# Altium schematic sheet analog_tmp.SchDoc
size A2; SheetNumber: 3; SheetTotal: 3
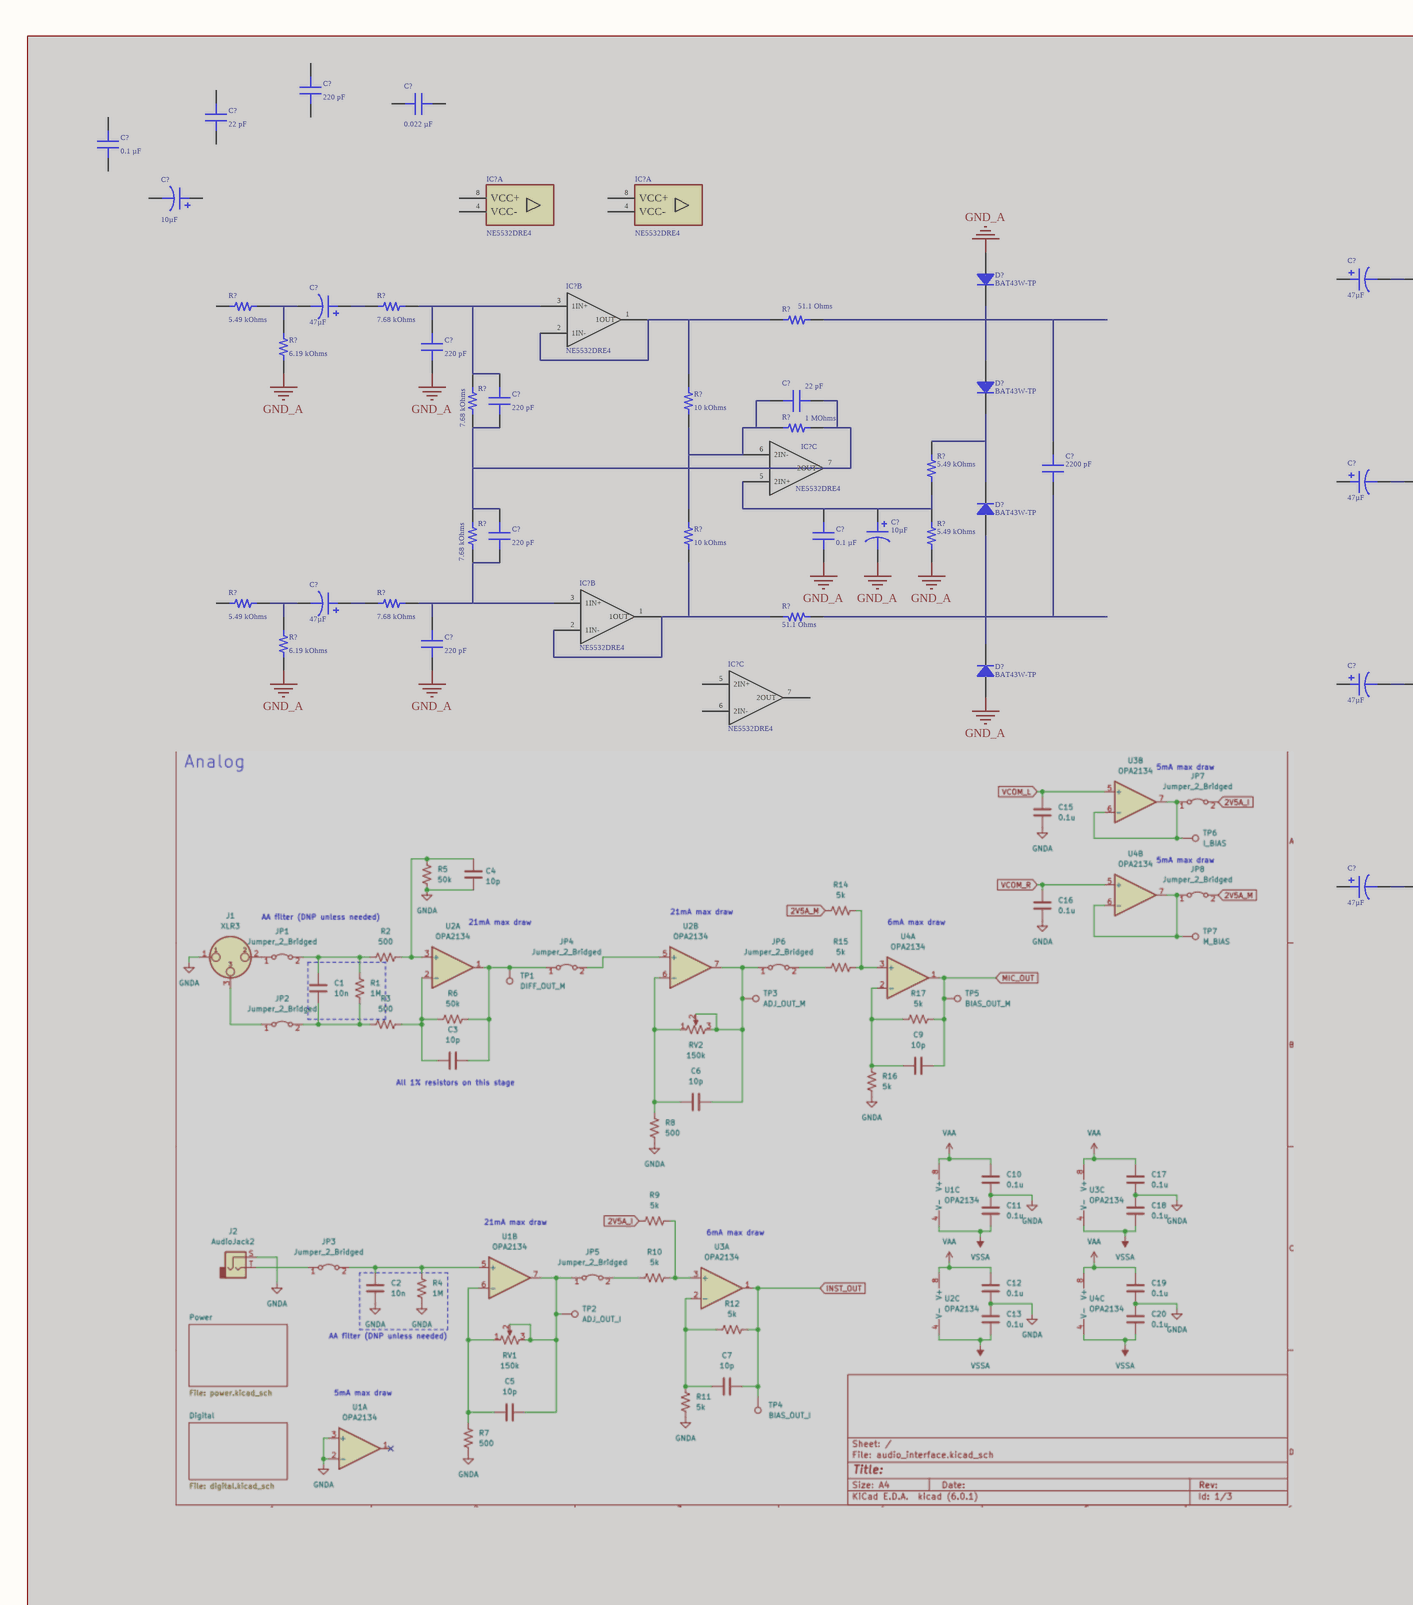
[diagram p0: analog_tmp.SchDoc, left]
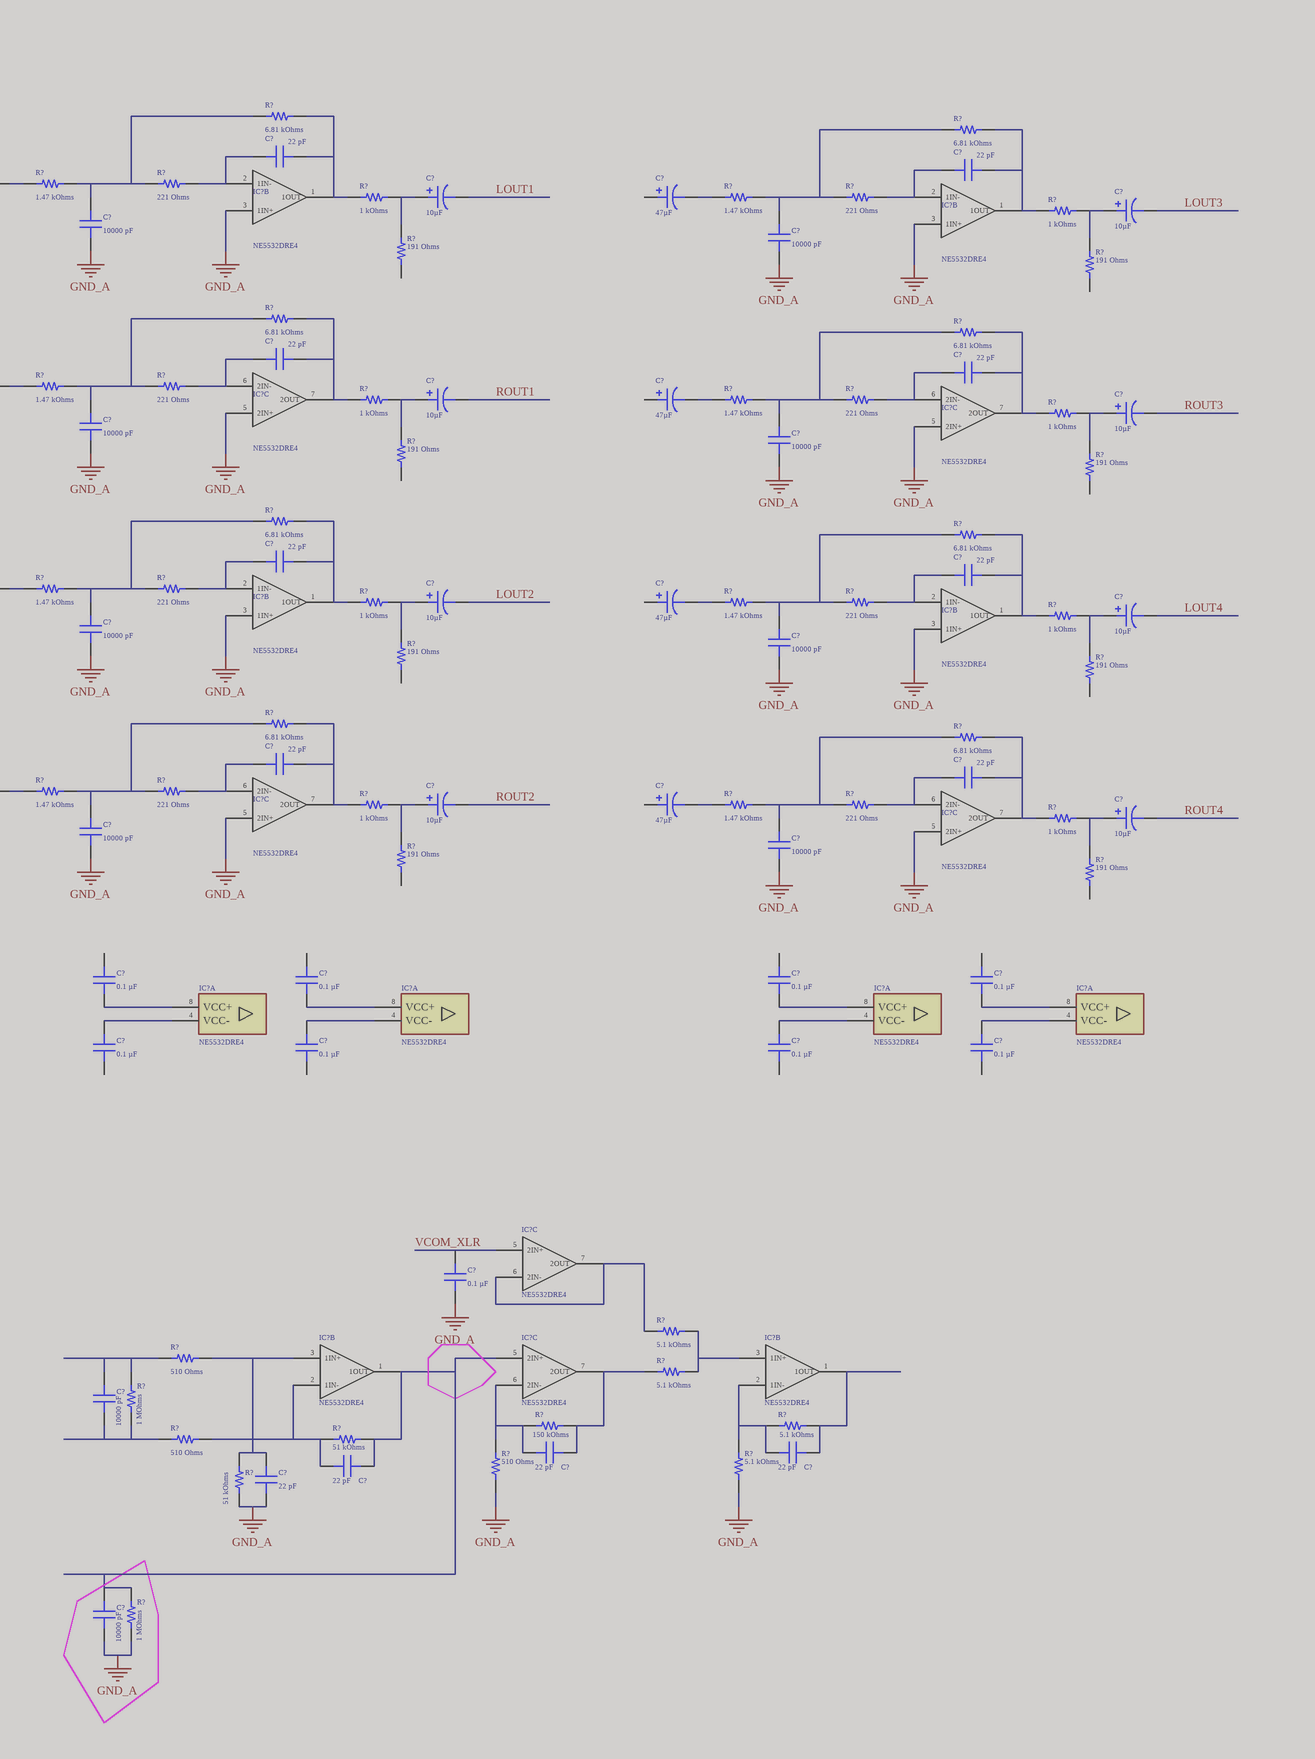
[diagram p1: analog_tmp.SchDoc, right]

## Parts
(Parts that share a designator on the sheet are numbered #1, #2 ... from top to bottom, then left to right.)
C?#1  220 pF  [CAP 0603_1608]  (masked out: inside a compile mask, not in the netlist)
C?#2  0.022 µF  [CAP 0603_1608]  (masked out: inside a compile mask, not in the netlist)
C?#3  22 pF  [CAP 0603_1608]  (masked out: inside a compile mask, not in the netlist)
C?#4  0.1 µF  [CAP 0603_1608]  (masked out: inside a compile mask, not in the netlist)
C?#5  10µF  [CAP POL 1206_3216]  (masked out: inside a compile mask, not in the netlist)
C?#6  22 pF  [CAP 0603_1608]  (masked out: inside a compile mask, not in the netlist)
C?#7  22 pF  [CAP 0603_1608]  (masked out: inside a compile mask, not in the netlist)
C?#8  47µF  [CAP POL 2917_7343]  (masked out: inside a compile mask, not in the netlist)
C?#9  10µF  [CAP POL 1206_3216]  (masked out: inside a compile mask, not in the netlist)
C?#10  47µF  [CAP POL 2917_7343]  (masked out: inside a compile mask, not in the netlist)
C?#11  47µF  [CAP POL 2917_7343]  (masked out: inside a compile mask, not in the netlist)
C?#12  10µF  [CAP POL 1206_3216]  (masked out: inside a compile mask, not in the netlist)
C?#13  10000 pF  [MURATA GRM188 0603_1608]  (masked out: inside a compile mask, not in the netlist)
C?#14  10000 pF  [MURATA GRM188 0603_1608]  (masked out: inside a compile mask, not in the netlist)
C?#15  220 pF  [CAP 0603_1608]  (masked out: inside a compile mask, not in the netlist)
C?#16  220 pF  [CAP 0603_1608]  (masked out: inside a compile mask, not in the netlist)
C?#17  22 pF  [CAP 0603_1608]  (masked out: inside a compile mask, not in the netlist)
C?#18  22 pF  [CAP 0603_1608]  (masked out: inside a compile mask, not in the netlist)
C?#19  2200 pF  [CAP 0603_1608]  (masked out: inside a compile mask, not in the netlist)
C?#20  22 pF  [CAP 0603_1608]  (masked out: inside a compile mask, not in the netlist)
C?#21  47µF  [CAP POL 2917_7343]  (masked out: inside a compile mask, not in the netlist)
C?#22  10µF  [CAP POL 1206_3216]  (masked out: inside a compile mask, not in the netlist)
C?#23  47µF  [CAP POL 2917_7343]  (masked out: inside a compile mask, not in the netlist)
C?#24  10µF  [CAP POL 1206_3216]  (masked out: inside a compile mask, not in the netlist)
C?#25  10000 pF  [MURATA GRM188 0603_1608]  (masked out: inside a compile mask, not in the netlist)
C?#26  220 pF  [CAP 0603_1608]  (masked out: inside a compile mask, not in the netlist)
C?#27  0.1 µF  [CAP 0603_1608]  (masked out: inside a compile mask, not in the netlist)
C?#28  10µF  [CAP POL 1206_3216]  (masked out: inside a compile mask, not in the netlist)
C?#29  10000 pF  [MURATA GRM188 0603_1608]  (masked out: inside a compile mask, not in the netlist)
C?#30  47µF  [CAP POL 2917_7343]  (masked out: inside a compile mask, not in the netlist)
C?#31  220 pF  [CAP 0603_1608]  (masked out: inside a compile mask, not in the netlist)
C?#32  22 pF  [CAP 0603_1608]  (masked out: inside a compile mask, not in the netlist)
C?#33  22 pF  [CAP 0603_1608]  (masked out: inside a compile mask, not in the netlist)
C?#34  47µF  [CAP POL 2917_7343]  (masked out: inside a compile mask, not in the netlist)
C?#35  10µF  [CAP POL 1206_3216]  (masked out: inside a compile mask, not in the netlist)
C?#36  47µF  [CAP POL 2917_7343]  (masked out: inside a compile mask, not in the netlist)
C?#37  10µF  [CAP POL 1206_3216]  (masked out: inside a compile mask, not in the netlist)
C?#38  10000 pF  [MURATA GRM188 0603_1608]  (masked out: inside a compile mask, not in the netlist)
C?#39  10000 pF  [MURATA GRM188 0603_1608]  (masked out: inside a compile mask, not in the netlist)
C?#40  22 pF  [CAP 0603_1608]  (masked out: inside a compile mask, not in the netlist)
C?#41  22 pF  [CAP 0603_1608]  (masked out: inside a compile mask, not in the netlist)
C?#42  47µF  [CAP POL 2917_7343]  (masked out: inside a compile mask, not in the netlist)
C?#43  10µF  [CAP POL 1206_3216]  (masked out: inside a compile mask, not in the netlist)
C?#44  47µF  [CAP POL 2917_7343]  (masked out: inside a compile mask, not in the netlist)
C?#45  10µF  [CAP POL 1206_3216]  (masked out: inside a compile mask, not in the netlist)
C?#46  10000 pF  [MURATA GRM188 0603_1608]  (masked out: inside a compile mask, not in the netlist)
C?#47  10000 pF  [MURATA GRM188 0603_1608]  (masked out: inside a compile mask, not in the netlist)
C?#48  0.1 µF  [CAP 0603_1608]  (masked out: inside a compile mask, not in the netlist)
C?#49  0.1 µF  [CAP 0603_1608]  (masked out: inside a compile mask, not in the netlist)
C?#50  0.1 µF  [CAP 0603_1608]  (masked out: inside a compile mask, not in the netlist)
C?#51  0.1 µF  [CAP 0603_1608]  (masked out: inside a compile mask, not in the netlist)
C?#52  0.1 µF  [CAP 0603_1608]  (masked out: inside a compile mask, not in the netlist)
C?#53  0.1 µF  [CAP 0603_1608]  (masked out: inside a compile mask, not in the netlist)
C?#54  0.1 µF  [CAP 0603_1608]  (masked out: inside a compile mask, not in the netlist)
C?#55  0.1 µF  [CAP 0603_1608]  (masked out: inside a compile mask, not in the netlist)
C?#56  0.1 µF  [CAP 0603_1608]  (masked out: inside a compile mask, not in the netlist)
C?#57  10000 pF  [MURATA GRM188 0603_1608]  (masked out: inside a compile mask, not in the netlist)
C?#58  22 pF  [CAP 0603_1608]  (masked out: inside a compile mask, not in the netlist)
C?#59  22 pF  [CAP 0603_1608]  (masked out: inside a compile mask, not in the netlist)
C?#60  22 pF  [CAP 0603_1608]  (masked out: inside a compile mask, not in the netlist)
C?#61  22 pF  [CAP 0603_1608]  (masked out: inside a compile mask, not in the netlist)
C?#62  10000 pF  [MURATA GRM188 0603_1608]  (masked out: inside a compile mask, not in the netlist)
D?#1  BAT43W-TP  [SOD-123]  (masked out: inside a compile mask, not in the netlist)
D?#2  BAT43W-TP  [SOD-123]  (masked out: inside a compile mask, not in the netlist)
D?#3  BAT43W-TP  [SOD-123]  (masked out: inside a compile mask, not in the netlist)
D?#4  BAT43W-TP  [SOD-123]  (masked out: inside a compile mask, not in the netlist)
IC?#1  NE5532DRE4  [SOIC127P600X175-8N]  (part A of 3)  (masked out: inside a compile mask, not in the netlist)
IC?#2  NE5532DRE4  [SOIC127P600X175-8N]  (part A of 3)  (masked out: inside a compile mask, not in the netlist)
IC?#3  NE5532DRE4  [SOIC127P600X175-8N]  (part B of 3)  (masked out: inside a compile mask, not in the netlist)
IC?#4  NE5532DRE4  [SOIC127P600X175-8N]  (part B of 3)  (masked out: inside a compile mask, not in the netlist)
IC?#5  NE5532DRE4  [SOIC127P600X175-8N]  (part B of 3)  (masked out: inside a compile mask, not in the netlist)
IC?#6  NE5532DRE4  [SOIC127P600X175-8N]  (part C of 3)  (masked out: inside a compile mask, not in the netlist)
IC?#7  NE5532DRE4  [SOIC127P600X175-8N]  (part C of 3)  (masked out: inside a compile mask, not in the netlist)
IC?#8  NE5532DRE4  [SOIC127P600X175-8N]  (part C of 3)  (masked out: inside a compile mask, not in the netlist)
IC?#9  NE5532DRE4  [SOIC127P600X175-8N]  (part B of 3)  (masked out: inside a compile mask, not in the netlist)
IC?#10  NE5532DRE4  [SOIC127P600X175-8N]  (part C of 3)  (masked out: inside a compile mask, not in the netlist)
IC?#11  NE5532DRE4  [SOIC127P600X175-8N]  (part B of 3)  (masked out: inside a compile mask, not in the netlist)
IC?#12  NE5532DRE4  [SOIC127P600X175-8N]  (part B of 3)  (masked out: inside a compile mask, not in the netlist)
IC?#13  NE5532DRE4  [SOIC127P600X175-8N]  (part C of 3)  (masked out: inside a compile mask, not in the netlist)
IC?#14  NE5532DRE4  [SOIC127P600X175-8N]  (part C of 3)  (masked out: inside a compile mask, not in the netlist)
IC?#15  NE5532DRE4  [SOIC127P600X175-8N]  (part A of 3)  (masked out: inside a compile mask, not in the netlist)
IC?#16  NE5532DRE4  [SOIC127P600X175-8N]  (part A of 3)  (masked out: inside a compile mask, not in the netlist)
IC?#17  NE5532DRE4  [SOIC127P600X175-8N]  (part A of 3)  (masked out: inside a compile mask, not in the netlist)
IC?#18  NE5532DRE4  [SOIC127P600X175-8N]  (part A of 3)  (masked out: inside a compile mask, not in the netlist)
IC?#19  NE5532DRE4  [SOIC127P600X175-8N]  (part C of 3)  (masked out: inside a compile mask, not in the netlist)
IC?#20  NE5532DRE4  [SOIC127P600X175-8N]  (part B of 3)  (masked out: inside a compile mask, not in the netlist)
IC?#21  NE5532DRE4  [SOIC127P600X175-8N]  (part C of 3)  (masked out: inside a compile mask, not in the netlist)
IC?#22  NE5532DRE4  [SOIC127P600X175-8N]  (part B of 3)  (masked out: inside a compile mask, not in the netlist)
R?#1  6.81 kOhms  [YAGEO RES 0603_1608]  (masked out: inside a compile mask, not in the netlist)
R?#2  6.81 kOhms  [YAGEO RES 0603_1608]  (masked out: inside a compile mask, not in the netlist)
R?#3  1.47 kOhms  [YAGEO RES 0603_1608]  (masked out: inside a compile mask, not in the netlist)
R?#4  221 Ohms  [YAGEO RES 0603_1608]  (masked out: inside a compile mask, not in the netlist)
R?#5  1 kOhms  [YAGEO RES 0603_1608]  (masked out: inside a compile mask, not in the netlist)
R?#6  1.47 kOhms  [YAGEO RES 0603_1608]  (masked out: inside a compile mask, not in the netlist)
R?#7  221 Ohms  [YAGEO RES 0603_1608]  (masked out: inside a compile mask, not in the netlist)
R?#8  5.49 kOhms  [YAGEO RES 0603_1608]  (masked out: inside a compile mask, not in the netlist)
R?#9  7.68 kOhms  [YAGEO RES 0603_1608]  (masked out: inside a compile mask, not in the netlist)
R?#10  1 kOhms  [YAGEO RES 0603_1608]  (masked out: inside a compile mask, not in the netlist)
R?#11  51.1 Ohms  [YAGEO RES 0603_1608]  (masked out: inside a compile mask, not in the netlist)
R?#12  6.19 kOhms  [YAGEO RES 0603_1608]  (masked out: inside a compile mask, not in the netlist)
R?#13  191 Ohms  [YAGEO RES 0603_1608]  (masked out: inside a compile mask, not in the netlist)
R?#14  191 Ohms  [YAGEO RES 0603_1608]  (masked out: inside a compile mask, not in the netlist)
R?#15  7.68 kOhms  [YAGEO RES 0603_1608]  (masked out: inside a compile mask, not in the netlist)
R?#16  10 kOhms  [RES 0603_1608]  (masked out: inside a compile mask, not in the netlist)
R?#17  6.81 kOhms  [YAGEO RES 0603_1608]  (masked out: inside a compile mask, not in the netlist)
R?#18  value 1 MOhms  [RES 0603_1608]  (masked out: inside a compile mask, not in the netlist)
R?#19  6.81 kOhms  [YAGEO RES 0603_1608]  (masked out: inside a compile mask, not in the netlist)
R?#20  5.49 kOhms  [YAGEO RES 0603_1608]  (masked out: inside a compile mask, not in the netlist)
R?#21  1.47 kOhms  [YAGEO RES 0603_1608]  (masked out: inside a compile mask, not in the netlist)
R?#22  221 Ohms  [YAGEO RES 0603_1608]  (masked out: inside a compile mask, not in the netlist)
R?#23  1 kOhms  [YAGEO RES 0603_1608]  (masked out: inside a compile mask, not in the netlist)
R?#24  1.47 kOhms  [YAGEO RES 0603_1608]  (masked out: inside a compile mask, not in the netlist)
R?#25  221 Ohms  [YAGEO RES 0603_1608]  (masked out: inside a compile mask, not in the netlist)
R?#26  1 kOhms  [YAGEO RES 0603_1608]  (masked out: inside a compile mask, not in the netlist)
R?#27  7.68 kOhms  [YAGEO RES 0603_1608]  (masked out: inside a compile mask, not in the netlist)
R?#28  10 kOhms  [RES 0603_1608]  (masked out: inside a compile mask, not in the netlist)
R?#29  5.49 kOhms  [YAGEO RES 0603_1608]  (masked out: inside a compile mask, not in the netlist)
R?#30  191 Ohms  [YAGEO RES 0603_1608]  (masked out: inside a compile mask, not in the netlist)
R?#31  191 Ohms  [YAGEO RES 0603_1608]  (masked out: inside a compile mask, not in the netlist)
R?#32  5.49 kOhms  [YAGEO RES 0603_1608]  (masked out: inside a compile mask, not in the netlist)
R?#33  7.68 kOhms  [YAGEO RES 0603_1608]  (masked out: inside a compile mask, not in the netlist)
R?#34  51.1 Ohms  [YAGEO RES 0603_1608]  (masked out: inside a compile mask, not in the netlist)
R?#35  6.81 kOhms  [YAGEO RES 0603_1608]  (masked out: inside a compile mask, not in the netlist)
R?#36  6.81 kOhms  [YAGEO RES 0603_1608]  (masked out: inside a compile mask, not in the netlist)
R?#37  6.19 kOhms  [YAGEO RES 0603_1608]  (masked out: inside a compile mask, not in the netlist)
R?#38  1.47 kOhms  [YAGEO RES 0603_1608]  (masked out: inside a compile mask, not in the netlist)
R?#39  221 Ohms  [YAGEO RES 0603_1608]  (masked out: inside a compile mask, not in the netlist)
R?#40  1 kOhms  [YAGEO RES 0603_1608]  (masked out: inside a compile mask, not in the netlist)
R?#41  1.47 kOhms  [YAGEO RES 0603_1608]  (masked out: inside a compile mask, not in the netlist)
R?#42  221 Ohms  [YAGEO RES 0603_1608]  (masked out: inside a compile mask, not in the netlist)
R?#43  1 kOhms  [YAGEO RES 0603_1608]  (masked out: inside a compile mask, not in the netlist)
R?#44  191 Ohms  [YAGEO RES 0603_1608]  (masked out: inside a compile mask, not in the netlist)
R?#45  191 Ohms  [YAGEO RES 0603_1608]  (masked out: inside a compile mask, not in the netlist)
R?#46  6.81 kOhms  [YAGEO RES 0603_1608]  (masked out: inside a compile mask, not in the netlist)
R?#47  6.81 kOhms  [YAGEO RES 0603_1608]  (masked out: inside a compile mask, not in the netlist)
R?#48  1.47 kOhms  [YAGEO RES 0603_1608]  (masked out: inside a compile mask, not in the netlist)
R?#49  221 Ohms  [YAGEO RES 0603_1608]  (masked out: inside a compile mask, not in the netlist)
R?#50  1 kOhms  [YAGEO RES 0603_1608]  (masked out: inside a compile mask, not in the netlist)
R?#51  1.47 kOhms  [YAGEO RES 0603_1608]  (masked out: inside a compile mask, not in the netlist)
R?#52  221 Ohms  [YAGEO RES 0603_1608]  (masked out: inside a compile mask, not in the netlist)
R?#53  1 kOhms  [YAGEO RES 0603_1608]  (masked out: inside a compile mask, not in the netlist)
R?#54  191 Ohms  [YAGEO RES 0603_1608]  (masked out: inside a compile mask, not in the netlist)
R?#55  191 Ohms  [YAGEO RES 0603_1608]  (masked out: inside a compile mask, not in the netlist)
R?#56  5.1 kOhms  [YAGEO RES 0603_1608]  (masked out: inside a compile mask, not in the netlist)
R?#57  510 Ohms  [YAGEO RES 0603_1608]  (masked out: inside a compile mask, not in the netlist)
R?#58  5.1 kOhms  [YAGEO RES 0603_1608]  (masked out: inside a compile mask, not in the netlist)
R?#59  value 1 MOhms  [RES 0603_1608]  (masked out: inside a compile mask, not in the netlist)
R?#60  150 kOhms  [YAGEO RES 0603_1608]  (masked out: inside a compile mask, not in the netlist)
R?#61  5.1 kOhms  [YAGEO RES 0603_1608]  (masked out: inside a compile mask, not in the netlist)
R?#62  510 Ohms  [YAGEO RES 0603_1608]  (masked out: inside a compile mask, not in the netlist)
R?#63  51 kOhms  [YAGEO RES 0603_1608]  (masked out: inside a compile mask, not in the netlist)
R?#64  510 Ohms  [YAGEO RES 0603_1608]  (masked out: inside a compile mask, not in the netlist)
R?#65  5.1 kOhms  [YAGEO RES 0603_1608]  (masked out: inside a compile mask, not in the netlist)
R?#66  51 kOhms  [YAGEO RES 0603_1608]  (masked out: inside a compile mask, not in the netlist)
R?#67  value 1 MOhms  [RES 0603_1608]  (masked out: inside a compile mask, not in the netlist)

## Library data of the parts
C?#1 C?#15 C?#16 C?#26 C?#31 = C0603C221K5RAC7867: CAP CER 220PF 50V X7R 0603; manufacturer: KEMET; Tolerance: ±10%; Part Number: C0603C221K5RAC7867; Value: 220 pF; Applications: Bypass, Decoupling; Capacitance: 220 pF; componentlink1description: Datasheet; componentlink1url: https://api.kemet.com/component-edge/download/datasheet/C0603C221K5RACTU.pdf; componentlink2description: DigiKey Link; componentlink2url: https://www.digikey.com/en/products/detail/kemet/C0603C221K5RAC7867/411073; Device Package: 0603 (1608 Metric); lastupdated: 9/22/2023 7:08:22 PM; Lifecycle Status: Active; Minimum Order: 1; Mounting Type: Surface Mount, MLCC; Operating Temperature: -55°C ~ 125°C; Package / Case: 0603 (1608 Metric); packaging: TapeAndReel; partid: 35307; Part Status: Active; price: 0.01; series: SMD Comm X7R; Size / Dimension: 0.063" L x 0.031" W (1.60mm x 0.80mm); Supplier 1: DigiKey; Supplier Part Number 1: 399-C0603C221K5RAC7867CT-ND; Temperature Coefficient: X7R; Thickness (Max): 0.034" (0.87mm); Voltage - Rated: 50V
C?#2 = C1608X8R1H223K080AA: CAP CER 0.022UF 50V X8R 0603; manufacturer: TDK Corporation; Tolerance: ±10%; Part Number: C1608X8R1H223K080AA; Capacitance: 0.022 µF; Applications: General Purpose; componentlink1description: Datasheet; componentlink1url: https://product.tdk.com/info/en/catalog/datasheets/mlcc_commercial_hightemp_en.pdf?ref_disty=digikey; componentlink2description: DigiKey Link; componentlink2url: https://www.digikey.com/en/products/detail/tdk-corporation/C1608X8R1H223K080AA/927131; Device Package: 0603 (1608 Metric); Features: High Temperature; lastupdated: 2/9/2024 8:10:29 PM; Lifecycle Status: Active; Minimum Order: 1; Mounting Type: Surface Mount, MLCC; Operating Temperature: -55°C ~ 150°C; Package / Case: 0603 (1608 Metric); packaging: TapeAndReel; partid: 2882; Part Status: Active; price: 0.01; series: C; Size / Dimension: 0.063" L x 0.031" W (1.60mm x 0.80mm); Supplier 1: DigiKey; Supplier Part Number 1: 445-2505-1-ND; Temperature Coefficient: X8R; Thickness (Max): 0.035" (0.90mm); value: 0.022 µF; Voltage - Rated: 50V
C?#3 C?#6 C?#7 C?#17 C?#18 C?#20 C?#32 C?#33 C?#40 C?#41 C?#58-C?#61 = CC0603GRNPO9BN220: CAP CER 22PF 50V C0G/NPO 0603; manufacturer: Yageo; Temperature Coefficient: C0G, NP0; Tolerance: ±2%; Part Number: CC0603GRNPO9BN220; Capacitance: 22 pF; Applications: General Purpose; componentlink1description: Datasheet; componentlink1url: https://www.yageo.com/upload/media/product/productsearch/datasheet/mlcc/UPY-GP_NP0_16V-to-50V_17.pdf; componentlink2description: DigiKey Link; componentlink2url: https://www.digikey.com/en/products/detail/yageo/CC0603GRNPO9BN220/5883550; Device Package: 0603 (1608 Metric); lastupdated: 2/9/2024 8:10:28 PM; Lifecycle Status: Active; Minimum Order: 1; Mounting Type: Surface Mount, MLCC; Operating Temperature: -55°C ~ 125°C; Package / Case: 0603 (1608 Metric); packaging: TapeAndReel; partid: 3677; Part Status: Active; price: 0.01; series: CC; Size / Dimension: 0.063" L x 0.031" W (1.60mm x 0.80mm); Supplier 1: DigiKey; Supplier Part Number 1: 311-3925-1-ND; Thickness (Max): 0.035" (0.90mm); value: 22 pF; Voltage - Rated: 50V
C?#4 C?#27 C?#48-C?#56 = C0603C104K5RAC7411: CAP CER 0.1UF 50V X7R 0603; manufacturer: KEMET; Tolerance: ±10%; Part Number: C0603C104K5RAC7411; Value: 0.1 µF; Applications: Bypass, Decoupling; Capacitance: 0.1 µF; componentlink1description: Datasheet; componentlink1url: https://api.kemet.com/component-edge/download/datasheet/C0603C104K5RAC7411.pdf; componentlink2description: DigiKey Link; componentlink2url: https://www.digikey.com/en/products/detail/kemet/C0603C104K5RAC7411/3317013; Device Package: 0603 (1608 Metric); lastupdated: 2/9/2024 8:10:30 PM; Lifecycle Status: Active; Minimum Order: 1; Mounting Type: Surface Mount, MLCC; Operating Temperature: -55°C ~ 125°C; Package / Case: 0603 (1608 Metric); packaging: TapeAndReel; partid: 2233; Part Status: Active; price: 0.01; series: SMD Comm X7R; Size / Dimension: 0.063" L x 0.031" W (1.60mm x 0.80mm); Supplier 1: DigiKey; Supplier Part Number 1: 399-C0603C104K5RAC7411CT-ND; Temperature Coefficient: X7R; Thickness (Max): 0.035" (0.90mm); Voltage - Rated: 50V
C?#5 C?#9 C?#12 C?#22 C?#24 C?#28 C?#35 C?#37 C?#43 C?#45 = T491A106K010AT: CAP TANT 10UF 10% 10V 1206; Manufacturer: KEMET; Manufacturer Size Code: A; ESR (Equivalent Series Resistance): 3.8Ohm; Lifetime @ Temp.: 2000 Hrs @ 125°C; Type: Molded; Part Number: T491A106K010AT; Value: 10µF; Capacitance: 10µF; ComponentLink1Description: Datasheet; ComponentLink1URL: https://api.kemet.com/component-edge/download/datasheet/T491A106K010AT.pdf; ComponentLink2Description: DigiKey Link; ComponentLink2URL: http://digikey.com/product-detail/en/kemet/T491A106K010AT/399-3684-1-ND/819009; Device Package: 1206 (3216 Metric); Features: General Purpose; Height - Seated (Max): 0.071" (1.80mm); LastUpdated: 9/2/2020 1:15:58 AM; Lifecycle Status: Active; Minimum Order: 1; Mounting Type: Surface Mount; Operating Temperature: -55°C ~ 125°C; Package / Case: 1206 (3216 Metric); Packaging: TapeAndReel; PartId: 330; Part Status: Active; Price: 0.07; Series: T491; Size / Dimension: 0.126" L x 0.063" W (3.20mm x 1.60mm); Supplier 1: DigiKey; Supplier Part Number 1: 399-3684-1-ND; Tolerance: ±10%; Voltage - Rated: 10V
C?#8 C?#10 C?#11 C?#21 C?#23 C?#30 C?#34 C?#36 C?#42 C?#44 = 293D476X9010D2TE3: CAP TANT 47UF 10% 10V 2917; Manufacturer: Vishay Sprague; Manufacturer Size Code: D; ESR (Equivalent Series Resistance): 700mOhm; Type: Molded; Part Number: 293D476X9010D2TE3; Value: 47µF; Capacitance: 47µF; ComponentLink1Description: Datasheet; ComponentLink1URL: http://www.vishay.com/docs/40002/293d.pdf; ComponentLink2Description: DigiKey Link; ComponentLink2URL: http://digikey.com/product-detail/en/vishay-sprague/293D476X9010D2TE3/718-1088-1-ND/1559582; Device Package: 2917 (7343 Metric); Features: General Purpose; Height - Seated (Max): 0.122" (3.10mm); LastUpdated: 9/2/2020 1:16:14 AM; Lifecycle Status: Active; Minimum Order: 1; Mounting Type: Surface Mount; Operating Temperature: -55°C ~ 125°C; Package / Case: 2917 (7343 Metric); Packaging: TapeAndReel; PartId: 2778; Part Status: Active; Price: 0.22; Series: TANTAMOUNT®, 293D; Size / Dimension: 0.287" L x 0.169" W (7.30mm x 4.30mm); Supplier 1: DigiKey; Supplier Part Number 1: 718-1088-1-ND; Tolerance: ±10%; Voltage - Rated: 10V
C?#13 C?#14 C?#25 C?#29 C?#38 C?#39 C?#46 C?#47 C?#57 C?#62 = GRM1885C1H103JA01D: CAP CER 10000PF 50V C0G/NP0 0603; manufacturer: Murata Electronics; Temperature Coefficient: C0G, NP0; Tolerance: ±5%; Part Number: GRM1885C1H103JA01D; Capacitance: 10000 pF; Applications: General Purpose; componentlink1description: Datasheet; componentlink1url: https://www.murata.com/~/media/webrenewal/support/library/catalog/products/capacitor/mlcc/c02e.ashx?la=en-us; componentlink2description: DigiKey Link; componentlink2url: https://www.digikey.com/en/products/detail/murata-electronics/GRM1885C1H103JA01D/4421555; Device Package: 0603 (1608 Metric); lastupdated: 7/20/2024 12:23:21 AM; Lifecycle Status: Active; Minimum Order: 1; Mounting Type: Surface Mount, MLCC; Operating Temperature: -55°C ~ 125°C; Package / Case: 0603 (1608 Metric); packaging: TapeAndReel; partid: 11077; Part Status: Active; price: 0.02; series: GRM; Size / Dimension: 0.063" L x 0.031" W (1.60mm x 0.80mm); Supplier 1: DigiKey; Supplier Part Number 1: 490-9666-1-ND; Thickness (Max): 0.035" (0.90mm); value: 10000 pF; Voltage - Rated: 50V
C?#19 = CC0603JRNPO9BN222: CAP CER 2200PF 50V C0G/NPO 0603; manufacturer: Yageo; Temperature Coefficient: C0G, NP0; Tolerance: ±5%; Part Number: CC0603JRNPO9BN222; Capacitance: 2200 pF; Applications: General Purpose; componentlink1description: Datasheet; componentlink1url: https://www.yageo.com/upload/media/product/productsearch/datasheet/mlcc/UPY-GP_NP0_16V-to-50V_17.pdf; componentlink2description: DigiKey Link; componentlink2url: https://www.digikey.com/en/products/detail/yageo/CC0603JRNPO9BN222/5195180; Device Package: 0603 (1608 Metric); lastupdated: 2/9/2024 8:10:30 PM; Lifecycle Status: Active; Minimum Order: 1; Mounting Type: Surface Mount, MLCC; Operating Temperature: -55°C ~ 125°C; Package / Case: 0603 (1608 Metric); packaging: TapeAndReel; partid: 2257; Part Status: Active; price: 0.01; series: CC; Size / Dimension: 0.063" L x 0.031" W (1.60mm x 0.80mm); Supplier 1: DigiKey; Supplier Part Number 1: 311-1771-1-ND; Thickness (Max): 0.035" (0.90mm); value: 2200 pF; Voltage - Rated: 50V
D?#1-D?#4 = BAT43W-TP: DIODE SCHOTTKY 30V 200MA SOD123; Manufacturer: Micro Commercial Co; Capacitance @ Vr, F: 7pF @ 1V, 1MHz; Current - Reverse Leakage @ Vr: 500 nA @ 25 V; Reverse Recovery Time (trr): 5 ns; Speed: Small Signal =< 200mA (Io), Any Speed; Voltage - Forward (Vf) (Max) @ If: 260 mV @ 2 mA; Part Number: BAT43W-TP; ComponentLink1Description: Datasheet; ComponentLink1URL: https://www.mccsemi.com/pdf/Products/BAT42W-BAT43W(SOD-123).pdf; ComponentLink2Description: DigiKey Link; ComponentLink2URL: https://www.digikey.com/en/products/detail/micro-commercial-co/BAT43W-TP/717224; Current - Average Rectified (Io): 200mA; Diode Type: Schottky; LastUpdated: 6/3/2024 7:54:44 PM; Lifecycle Status: Active; Minimum Order: 1; Mounting Type: Surface Mount; Operating Temperature - Junction: -55°C ~ 125°C; Package / Case: SOD-123; Packaging: TapeAndReel; PartId: 2321; Part Status: Active; Price: 0.02; Series: -; Supplier 1: DigiKey; Supplier Part Number 1: BAT43WTPMSCT-ND; Supplier Device Package: SOD-123; Voltage - DC Reverse (Vr) (Max): 30 V
IC?#1-IC?#22 = NE5532DRE4: Integrated Circuit; Manufacturer_Name: Texas Instruments; Datasheet Link: https://www.ti.com/lit/ds/symlink/ne5532.pdf?HQS=dis-mous-null-mousermode-dsf-pf-null-wwe&ts=1618482303902&ref_url=https%253A%252F%252Fwww.mouser.com%252F; Height: 1.75mm; Manufacturer_Part_Number: NE5532DRE4; Mouser Part Number: 595-NE5532DRE4; Mouser Price/Stock: https://www.mouser.co.uk/ProductDetail/Texas-Instruments/NE5532DRE4?qs=7nS3%252BbEUL6spPf9Rt7S6cg%3D%3D; Arrow Part Number: NE5532DRE4; Arrow Price/Stock: https://www.arrow.com/en/products/ne5532dre4/texas-instruments
R?#1 R?#2 R?#17 R?#19 R?#35 R?#36 R?#46 R?#47 = AC0603FR-076K81L: RES SMD 6.81K OHM 1% 1/10W 0603; Manufacturer: Yageo; Power (Watts): 0.1W, 1/10W; Temperature Coefficient: ±100ppm/°C; Part Number: AC0603FR-076K81L; Value: 6.81 kOhms; ComponentLink1Description: Datasheet; ComponentLink1URL: https://www.yageo.com/upload/media/product/productsearch/datasheet/rchip/PYu-AC_51_RoHS_L_7.pdf; ComponentLink2Description: DigiKey Link; ComponentLink2URL: https://www.digikey.com/en/products/detail/yageo/AC0603FR-076K81L/5896265; Composition: Thick Film; Device Package: 0603 (1608 Metric); Features: Automotive AEC-Q200, Moisture Resistant; Height - Seated (Max): 0.022" (0.55mm); LastUpdated: 7/25/2024 9:19:28 AM; Lifecycle Status: Active; Minimum Order: 1; Number of Terminations: 2; Operating Temperature: -55°C ~ 155°C; Package / Case: 0603 (1608 Metric); Packaging: CutTape; PartId: 11704; Part Status: Active; Price: 0.01; Ratings: AEC-Q200; Resistance: 6.81 kOhms; Series: AC; Size / Dimension: 0.063" L x 0.031" W (1.60mm x 0.80mm); Supplier 1: DigiKey; Supplier Part Number 1: YAG3626CT-ND; Supplier Device Package: 0603; Tolerance: ±1%
R?#3 R?#6 R?#21 R?#24 R?#38 R?#41 R?#48 R?#51 = AC0603FR-071K47L: RES SMD 1.47K OHM 1% 1/10W 0603; Manufacturer: Yageo; Power (Watts): 0.1W, 1/10W; Temperature Coefficient: ±100ppm/°C; Part Number: AC0603FR-071K47L; Value: 1.47 kOhms; ComponentLink1Description: Datasheet; ComponentLink1URL: https://www.yageo.com/upload/media/product/productsearch/datasheet/rchip/PYu-AC_51_RoHS_L_8.pdf; ComponentLink2Description: DigiKey Link; ComponentLink2URL: https://www.digikey.com/en/products/detail/yageo/AC0603FR-071K47L/5895863; Composition: Thick Film; Device Package: 0603 (1608 Metric); Features: Automotive AEC-Q200, Moisture Resistant; Height - Seated (Max): 0.022" (0.55mm); LastUpdated: 7/25/2024 9:19:11 AM; Lifecycle Status: Active; Minimum Order: 1; Number of Terminations: 2; Operating Temperature: -55°C ~ 155°C; Package / Case: 0603 (1608 Metric); Packaging: CutTape; PartId: 65725; Part Status: Active; Price: 0.01; Ratings: AEC-Q200; Resistance: 1.47 kOhms; Series: AC; Size / Dimension: 0.063" L x 0.031" W (1.60mm x 0.80mm); Supplier 1: DigiKey; Supplier Part Number 1: 13-AC0603FR-071K47LCT-ND; Supplier Device Package: 0603; Tolerance: ±1%
R?#4 R?#7 R?#22 R?#25 R?#39 R?#42 R?#49 R?#52 = AC0603FR-07221RL: RES SMD 221 OHM 1% 1/10W 0603; Manufacturer: Yageo; Power (Watts): 0.1W, 1/10W; Temperature Coefficient: ±100ppm/°C; Part Number: AC0603FR-07221RL; Value: 221 Ohms; ComponentLink1Description: Datasheet; ComponentLink1URL: https://www.yageo.com/upload/media/product/productsearch/datasheet/rchip/PYu-AC_51_RoHS_L_10.pdf; ComponentLink2Description: DigiKey Link; ComponentLink2URL: https://www.digikey.com/en/products/detail/yageo/AC0603FR-07221RL/5895921; Composition: Thick Film; Device Package: 0603 (1608 Metric); Features: Automotive AEC-Q200, Moisture Resistant; Height - Seated (Max): 0.022" (0.55mm); LastUpdated: 7/25/2024 9:18:59 AM; Lifecycle Status: Active; Minimum Order: 1; Number of Terminations: 2; Operating Temperature: -55°C ~ 155°C; Package / Case: 0603 (1608 Metric); Packaging: CutTape; PartId: 87217; Price: 0.01; Ratings: AEC-Q200; Resistance: 221 Ohms; Series: AC; Size / Dimension: 0.063" L x 0.031" W (1.60mm x 0.80mm); Supplier 1: DigiKey; Supplier Part Number 1: 13-AC0603FR-07221RLCT-ND; Supplier Device Package: 0603; Tolerance: ±1%
R?#5 R?#10 R?#23 R?#26 R?#40 R?#43 R?#50 R?#53 = AA0603FR-071KL: RES SMD 1K OHM 1% 1/10W 0603; Manufacturer: Yageo; Power (Watts): 0.1W, 1/10W; Temperature Coefficient: ±150ppm/°C; Part Number: AA0603FR-071KL; Value: 1 kOhms; ComponentLink1Description: Datasheet; ComponentLink1URL: https://www.yageo.com/upload/media/product/productsearch/datasheet/rchip/PYu-AA_51_RoHS_L_3.pdf; ComponentLink2Description: DigiKey Link; ComponentLink2URL: https://www.digikey.com/en/products/detail/yageo/AA0603FR-071KL/5888847; Composition: Thick Film; Device Package: 0603 (1608 Metric); Features: Anti-Sulfur, Automotive AEC-Q200, Moisture Resistant; Height - Seated (Max): 0.022" (0.55mm); LastUpdated: 7/25/2024 9:19:15 AM; Lifecycle Status: Active; Minimum Order: 1; Number of Terminations: 2; Operating Temperature: -55°C ~ 155°C; Package / Case: 0603 (1608 Metric); Packaging: TapeAndReel; PartId: 64335; Part Status: Active; Price: 0.01; Ratings: AEC-Q200; Resistance: 1 kOhms; Series: AA; Size / Dimension: 0.063" L x 0.031" W (1.60mm x 0.80mm); Supplier 1: DigiKey; Supplier Part Number 1: 13-AA0603FR-071KLCT-ND; Supplier Device Package: 0603; Tolerance: ±1%
R?#8 R?#20 R?#29 R?#32 = AC0603FR-075K49L: RES SMD 5.49K OHM 1% 1/10W 0603; Manufacturer: Yageo; Power (Watts): 0.1W, 1/10W; Temperature Coefficient: ±100ppm/°C; Part Number: AC0603FR-075K49L; Value: 5.49 kOhms; ComponentLink1Description: Datasheet; ComponentLink1URL: https://www.yageo.com/upload/media/product/productsearch/datasheet/rchip/PYu-AC_51_RoHS_L_8.pdf; ComponentLink2Description: DigiKey Link; ComponentLink2URL: https://www.digikey.com/en/products/detail/yageo/AC0603FR-075K49L/5896212; Composition: Thick Film; Device Package: 0603 (1608 Metric); Features: Automotive AEC-Q200, Moisture Resistant; Height - Seated (Max): 0.022" (0.55mm); LastUpdated: 7/25/2024 9:19:14 AM; Lifecycle Status: Active; Minimum Order: 1; Number of Terminations: 2; Operating Temperature: -55°C ~ 155°C; Package / Case: 0603 (1608 Metric); Packaging: CutTape; PartId: 64236; Part Status: Active; Price: 0.01; Ratings: AEC-Q200; Resistance: 5.49 kOhms; Series: AC; Size / Dimension: 0.063" L x 0.031" W (1.60mm x 0.80mm); Supplier 1: DigiKey; Supplier Part Number 1: 13-AC0603FR-075K49LCT-ND; Supplier Device Package: 0603; Tolerance: ±1%
R?#9 R?#15 R?#27 R?#33 = AC0603FR-077K68L: RES SMD 7.68K OHM 1% 1/10W 0603; Manufacturer: Yageo; Power (Watts): 0.1W, 1/10W; Temperature Coefficient: ±100ppm/°C; Part Number: AC0603FR-077K68L; Value: 7.68 kOhms; ComponentLink1Description: Datasheet; ComponentLink1URL: https://www.yageo.com/upload/media/product/productsearch/datasheet/rchip/PYu-AC_51_RoHS_L_10.pdf; ComponentLink2Description: DigiKey Link; ComponentLink2URL: https://www.digikey.com/en/products/detail/yageo/AC0603FR-077K68L/5896295; Composition: Thick Film; Device Package: 0603 (1608 Metric); Features: Automotive AEC-Q200, Moisture Resistant; Height - Seated (Max): 0.022" (0.55mm); LastUpdated: 7/25/2024 9:19:03 AM; Lifecycle Status: Active; Minimum Order: 1; Number of Terminations: 2; Operating Temperature: -55°C ~ 155°C; Package / Case: 0603 (1608 Metric); Packaging: CutTape; PartId: 79450; Price: 0.01; Ratings: AEC-Q200; Resistance: 7.68 kOhms; Series: AC; Size / Dimension: 0.063" L x 0.031" W (1.60mm x 0.80mm); Supplier 1: DigiKey; Supplier Part Number 1: 13-AC0603FR-077K68LCT-ND; Supplier Device Package: 0603; Tolerance: ±1%
R?#11 R?#34 = AC0603FR-0751R1L: RES SMD 51.1 OHM 1% 1/10W 0603; Manufacturer: Yageo; Power (Watts): 0.1W, 1/10W; Temperature Coefficient: ±100ppm/°C; Part Number: AC0603FR-0751R1L; Value: 51.1 Ohms; ComponentLink1Description: Datasheet; ComponentLink1URL: https://www.yageo.com/upload/media/product/productsearch/datasheet/rchip/PYu-AC_51_RoHS_L_9.pdf; ComponentLink2Description: DigiKey Link; ComponentLink2URL: https://www.digikey.com/en/products/detail/yageo/AC0603FR-0751R1L/5896180; Composition: Thick Film; Device Package: 0603 (1608 Metric); Features: Automotive AEC-Q200, Moisture Resistant; Height - Seated (Max): 0.022" (0.55mm); LastUpdated: 7/25/2024 9:19:05 AM; Lifecycle Status: Active; Minimum Order: 1; Number of Terminations: 2; Operating Temperature: -55°C ~ 155°C; Package / Case: 0603 (1608 Metric); Packaging: CutTape; PartId: 75740; Part Status: Active; Price: 0.01; Ratings: AEC-Q200; Resistance: 51.1 Ohms; Series: AC; Size / Dimension: 0.063" L x 0.031" W (1.60mm x 0.80mm); Supplier 1: DigiKey; Supplier Part Number 1: 13-AC0603FR-0751R1LCT-ND; Supplier Device Package: 0603; Tolerance: ±1%
R?#12 R?#37 = AC0603FR-076K19L: RES SMD 6.19K OHM 1% 1/10W 0603; Manufacturer: Yageo; Power (Watts): 0.1W, 1/10W; Temperature Coefficient: ±100ppm/°C; Part Number: AC0603FR-076K19L; Value: 6.19 kOhms; ComponentLink1Description: Datasheet; ComponentLink1URL: https://www.yageo.com/upload/media/product/productsearch/datasheet/rchip/PYu-AC_51_RoHS_L_9.pdf; ComponentLink2Description: DigiKey Link; ComponentLink2URL: https://www.digikey.com/en/products/detail/yageo/AC0603FR-076K19L/5896260; Composition: Thick Film; Device Package: 0603 (1608 Metric); Features: Automotive AEC-Q200, Moisture Resistant; Height - Seated (Max): 0.022" (0.55mm); LastUpdated: 7/25/2024 9:19:07 AM; Lifecycle Status: Active; Minimum Order: 1; Number of Terminations: 2; Operating Temperature: -55°C ~ 155°C; Package / Case: 0603 (1608 Metric); Packaging: CutTape; PartId: 72125; Part Status: Active; Price: 0.01; Ratings: AEC-Q200; Resistance: 6.19 kOhms; Series: AC; Size / Dimension: 0.063" L x 0.031" W (1.60mm x 0.80mm); Supplier 1: DigiKey; Supplier Part Number 1: 13-AC0603FR-076K19LCT-ND; Supplier Device Package: 0603; Tolerance: ±1%
R?#13 R?#14 R?#30 R?#31 R?#44 R?#45 R?#54 R?#55 = AC0603FR-07191RL: RES SMD 191 OHM 1% 1/10W 0603; Manufacturer: Yageo; Power (Watts): 0.1W, 1/10W; Temperature Coefficient: ±100ppm/°C; Part Number: AC0603FR-07191RL; Value: 191 Ohms; ComponentLink1Description: Datasheet; ComponentLink1URL: https://www.yageo.com/upload/media/product/productsearch/datasheet/rchip/PYu-AC_51_RoHS_L_9.pdf; ComponentLink2Description: DigiKey Link; ComponentLink2URL: https://www.digikey.com/en/products/detail/yageo/AC0603FR-07191RL/5895841; Composition: Thick Film; Device Package: 0603 (1608 Metric); Features: Automotive AEC-Q200, Moisture Resistant; Height - Seated (Max): 0.022" (0.55mm); LastUpdated: 7/25/2024 9:19:07 AM; Lifecycle Status: Active; Minimum Order: 1; Number of Terminations: 2; Operating Temperature: -55°C ~ 155°C; Package / Case: 0603 (1608 Metric); Packaging: CutTape; PartId: 72108; Part Status: Active; Price: 0.01; Ratings: AEC-Q200; Resistance: 191 Ohms; Series: AC; Size / Dimension: 0.063" L x 0.031" W (1.60mm x 0.80mm); Supplier 1: DigiKey; Supplier Part Number 1: 13-AC0603FR-07191RLCT-ND; Supplier Device Package: 0603; Tolerance: ±1%
R?#16 R?#28 = ERJ-3EKF1002V: RES SMD 10K OHM 1% 1/10W 0603; Manufacturer: Panasonic Electronic Components; Power (Watts): 0.1W, 1/10W; Temperature Coefficient: ±100ppm/°C; Part Number: ERJ-3EKF1002V; Value: 10 kOhms; ComponentLink1Description: Datasheet; ComponentLink1URL: https://industrial.panasonic.com/cdbs/www-data/pdf/RDA0000/AOA0000C304.pdf; ComponentLink2Description: DigiKey Link; ComponentLink2URL: https://www.digikey.com/en/products/detail/panasonic-electronic-components/ERJ-3EKF1002V/196066; Composition: Thick Film; Device Package: 0603 (1608 Metric); Height - Seated (Max): 0.022" (0.55mm); LastUpdated: 2/9/2024 8:41:59 PM; Lifecycle Status: Active; Minimum Order: 1; Number of Terminations: 2; Operating Temperature: -55°C ~ 155°C; Package / Case: 0603 (1608 Metric); Packaging: TapeAndReel; PartId: 25695; Part Status: Active; Price: 0.01; Resistance: 10 kOhms; Series: ERJ-3EK; Size / Dimension: 0.063" L x 0.031" W (1.60mm x 0.80mm); Supplier 1: DigiKey; Supplier Part Number 1: P10.0KHCT-ND; Supplier Device Package: 0603; Tolerance: ±1%; Features: Automotive AEC-Q200; Ratings: AEC-Q200
R?#18 R?#59 R?#67 = ERJ-3EKF1004V: RES SMD 1M OHM 1% 1/10W 0603; Manufacturer: Panasonic Electronic Components; Power (Watts): 0.1W, 1/10W; Temperature Coefficient: ±100ppm/°C; Part Number: ERJ-3EKF1004V; ComponentLink1Description: Datasheet; ComponentLink1URL: https://industrial.panasonic.com/cdbs/www-data/pdf/RDA0000/AOA0000C304.pdf; ComponentLink2Description: DigiKey Link; ComponentLink2URL: https://www.digikey.com/en/products/detail/panasonic-electronic-components/ERJ-3EKF1004V/196033; Composition: Thick Film; Device Package: 0603 (1608 Metric); Height - Seated (Max): 0.022" (0.55mm); LastUpdated: 2/9/2024 8:42:00 PM; Lifecycle Status: Active; Minimum Order: 1; Number of Terminations: 2; Operating Temperature: -55°C ~ 155°C; Package / Case: 0603 (1608 Metric); Packaging: TapeAndReel; PartId: 25691; Part Status: Active; Price: 0.01; Resistance: 1 MOhms; Series: ERJ-3EK; Size / Dimension: 0.063" L x 0.031" W (1.60mm x 0.80mm); Supplier 1: DigiKey; Supplier Part Number 1: P1.00MHCT-ND; Supplier Device Package: 0603; Tolerance: ±1%; Features: Automotive AEC-Q200; Ratings: AEC-Q200
R?#56 R?#58 R?#61 R?#65 = AC0603FR-075K1L: RES SMD 5.1K OHM 1% 1/10W 0603; Manufacturer: Yageo; Power (Watts): 0.1W, 1/10W; Temperature Coefficient: ±100ppm/°C; Part Number: AC0603FR-075K1L; Value: 5.1 kOhms; ComponentLink1Description: Datasheet; ComponentLink1URL: https://www.yageo.com/upload/media/product/productsearch/datasheet/rchip/PYu-AC_51_RoHS_L_7.pdf; ComponentLink2Description: DigiKey Link; ComponentLink2URL: https://www.digikey.com/en/products/detail/yageo/AC0603FR-075K1L/5896209; Composition: Thick Film; Device Package: 0603 (1608 Metric); Features: Automotive AEC-Q200, Moisture Resistant; Height - Seated (Max): 0.022" (0.55mm); LastUpdated: 7/25/2024 9:19:23 AM; Lifecycle Status: Active; Minimum Order: 1; Number of Terminations: 2; Operating Temperature: -55°C ~ 155°C; Package / Case: 0603 (1608 Metric); Packaging: CutTape; PartId: 17442; Part Status: Active; Price: 0.01; Ratings: AEC-Q200; Resistance: 5.1 kOhms; Series: AC; Size / Dimension: 0.063" L x 0.031" W (1.60mm x 0.80mm); Supplier 1: DigiKey; Supplier Part Number 1: YAG3621CT-ND; Supplier Device Package: 0603; Tolerance: ±1%
R?#57 R?#62 R?#64 = AC0603FR-07510RL: RES SMD 510 OHM 1% 1/10W 0603; Manufacturer: Yageo; Power (Watts): 0.1W, 1/10W; Temperature Coefficient: ±100ppm/°C; Part Number: AC0603FR-07510RL; Value: 510 Ohms; ComponentLink1Description: Datasheet; ComponentLink1URL: https://www.yageo.com/upload/media/product/productsearch/datasheet/rchip/PYu-AC_51_RoHS_L_7.pdf; ComponentLink2Description: DigiKey Link; ComponentLink2URL: https://www.digikey.com/en/products/detail/yageo/AC0603FR-07510RL/5896175; Composition: Thick Film; Device Package: 0603 (1608 Metric); Features: Automotive AEC-Q200, Moisture Resistant; Height - Seated (Max): 0.022" (0.55mm); LastUpdated: 7/25/2024 9:19:25 AM; Lifecycle Status: Active; Minimum Order: 1; Number of Terminations: 2; Operating Temperature: -55°C ~ 155°C; Package / Case: 0603 (1608 Metric); Packaging: CutTape; PartId: 15979; Part Status: Active; Price: 0.01; Ratings: AEC-Q200; Resistance: 510 Ohms; Series: AC; Size / Dimension: 0.063" L x 0.031" W (1.60mm x 0.80mm); Supplier 1: DigiKey; Supplier Part Number 1: YAG3615CT-ND; Supplier Device Package: 0603; Tolerance: ±1%
R?#60 = AC0603FR-07150KL: RES SMD 150K OHM 1% 1/10W 0603; Manufacturer: Yageo; Power (Watts): 0.1W, 1/10W; Temperature Coefficient: ±100ppm/°C; Part Number: AC0603FR-07150KL; Value: 150 kOhms; ComponentLink1Description: Datasheet; ComponentLink1URL: https://www.yageo.com/upload/media/product/productsearch/datasheet/rchip/PYu-AC_51_RoHS_L_7.pdf; ComponentLink2Description: DigiKey Link; ComponentLink2URL: https://www.digikey.com/en/products/detail/yageo/AC0603FR-07150KL/5895795; Composition: Thick Film; Device Package: 0603 (1608 Metric); Features: Automotive AEC-Q200, Moisture Resistant; Height - Seated (Max): 0.022" (0.55mm); LastUpdated: 7/25/2024 9:19:23 AM; Lifecycle Status: Active; Minimum Order: 1; Number of Terminations: 2; Operating Temperature: -55°C ~ 155°C; Package / Case: 0603 (1608 Metric); Packaging: CutTape; PartId: 17374; Part Status: Active; Price: 0.01; Ratings: AEC-Q200; Resistance: 150 kOhms; Series: AC; Size / Dimension: 0.063" L x 0.031" W (1.60mm x 0.80mm); Supplier 1: DigiKey; Supplier Part Number 1: YAG3567CT-ND; Supplier Device Package: 0603; Tolerance: ±1%
R?#63 R?#66 = AC0603FR-0751KL: RES SMD 51K OHM 1% 1/10W 0603; Manufacturer: Yageo; Power (Watts): 0.1W, 1/10W; Temperature Coefficient: ±100ppm/°C; Part Number: AC0603FR-0751KL; Value: 51 kOhms; ComponentLink1Description: Datasheet; ComponentLink1URL: https://www.yageo.com/upload/media/product/productsearch/datasheet/rchip/PYu-AC_51_RoHS_L_7.pdf; ComponentLink2Description: DigiKey Link; ComponentLink2URL: https://www.digikey.com/en/products/detail/yageo/AC0603FR-0751KL/5896179; Composition: Thick Film; Device Package: 0603 (1608 Metric); Features: Automotive AEC-Q200, Moisture Resistant; Height - Seated (Max): 0.022" (0.55mm); LastUpdated: 7/25/2024 9:19:23 AM; Lifecycle Status: Active; Minimum Order: 1; Number of Terminations: 2; Operating Temperature: -55°C ~ 155°C; Package / Case: 0603 (1608 Metric); Packaging: CutTape; PartId: 17419; Part Status: Active; Price: 0.01; Ratings: AEC-Q200; Resistance: 51 kOhms; Series: AC; Size / Dimension: 0.063" L x 0.031" W (1.60mm x 0.80mm); Supplier 1: DigiKey; Supplier Part Number 1: YAG3616CT-ND; Supplier Device Package: 0603; Tolerance: ±1%